# Altium schematic sheet positioningAndThermistor.SchDoc
size A4; DocumentNumber: 7; SheetNumber: 7; SheetTotal: 11
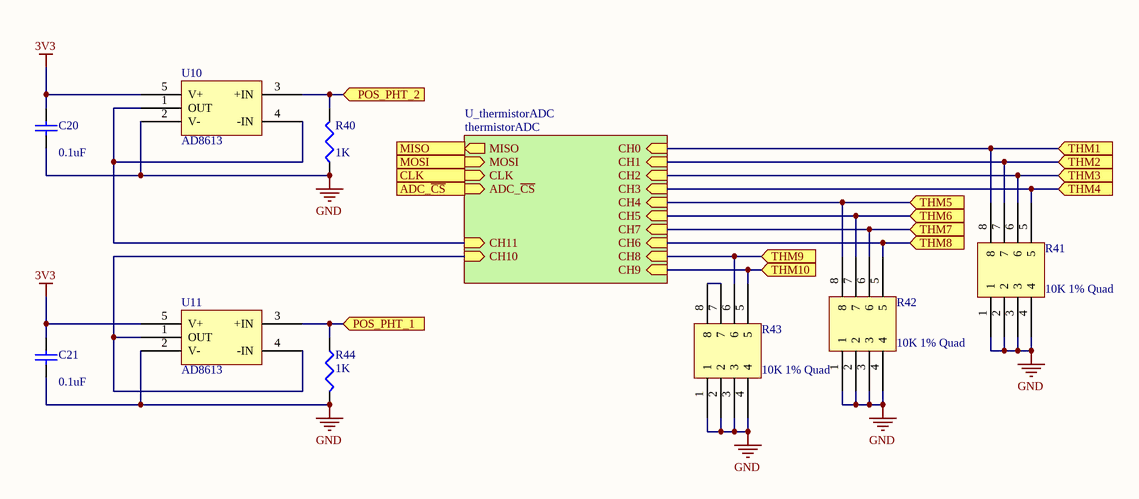
[diagram p0: positioningAndThermistor.SchDoc]

## Parts
C20  0.1uF  [0402]
C21  0.1uF  [0402]
R40  1K  [J1-0603]
R41  10K 1% Quad
R42  10K 1% Quad
R43  10K 1% Quad
R44  1K  [J1-0603]
U10  AD8613  [SOP-65P200X125-5N]
U11  AD8613  [SOP-65P200X125-5N]

## Sub-sheets
U_thermistorADC = thermistorADC: CH0 (in), CH1 (in), CH2 (in), CH3 (in), CH4 (in), CH5 (in), CH7 (in), CH6 (in), CH8 (in), CH9 (in), MOSI (in), MISO (out), ADC_~{CS} (in), CLK (in), CH11 (in), CH10 (in)

## Ports
ADC_~{CS} (in), CLK (in), MISO (out), MOSI (in), POS_PHT_1 (in), POS_PHT_2 (in), THM1 (in), THM2 (in), THM3 (in), THM4 (in), THM5 (in), THM6 (in), THM7 (in), THM8 (in), THM9 (in), THM10 (in)

## Nets
3V3: C20.2 C21.2 U10.5(V+) U11.5(V+)
GND: C20.1 C21.1 R40.1 R41.1 R41.2 R41.3 R41.4 R42.1 R42.2 R42.3 R42.4 R43.1 R43.2 R43.3 R43.4 R44.2 U10.2(V-) U11.2(V-)
ADC_~{CS}: port ADC_~{CS}, sheet U_thermistorADC/ADC_~{CS}
CLK: port CLK, sheet U_thermistorADC/CLK
MISO: port MISO, sheet U_thermistorADC/MISO
MOSI: port MOSI, sheet U_thermistorADC/MOSI
POS_PHT_1: R44.1 U11.3(+IN) ; port POS_PHT_1
POS_PHT_2: R40.2 U10.3(+IN) ; port POS_PHT_2
THM1: R41.8 ; port THM1, sheet U_thermistorADC/CH0
THM2: R41.7 ; port THM2, sheet U_thermistorADC/CH1
THM3: R41.6 ; port THM3, sheet U_thermistorADC/CH2
THM4: R41.5 ; port THM4, sheet U_thermistorADC/CH3
THM5: R42.8 ; port THM5, sheet U_thermistorADC/CH4
THM6: R42.7 ; port THM6, sheet U_thermistorADC/CH5
THM7: R42.6 ; port THM7, sheet U_thermistorADC/CH7
THM8: R42.5 ; port THM8, sheet U_thermistorADC/CH6
THM9: R43.6 ; port THM9, sheet U_thermistorADC/CH8
THM10: R43.5 ; port THM10, sheet U_thermistorADC/CH9
NetR43_7: R43.7 R43.8
NetU10_1: U10.1(OUT) U10.4(-IN) ; sheet U_thermistorADC/CH11
NetU11_1: U11.1(OUT) U11.4(-IN) ; sheet U_thermistorADC/CH10

## Library data of the parts
C20 C21 = Cap Semi: Capacitor (Semiconductor SIM Model); Published: 8-Jun-2000; LatestRevisionDate: 29-May-2009; LatestRevisionNote: IPC-7351 Footprint Added.; PackageReference: C1206; Publisher: Altium Limited; PackageDescription: Chip Capacitor; Value: 0.1uF; Supplier: Digi-Key; Supplier Part Number: 587-3807-1-ND
R40 R44 = Res3: Resistor; Published: 8-Jun-2000; LatestRevisionDate: 29-May-2009; LatestRevisionNote: IPC-7351 Footprint Added.; PackageReference: J1-0603; Publisher: Altium Limited; PackageDescription: Chip Resistor; Value: 1K; Supplier: Digi-Key
R41-R43 = Res Quad Pack: Quad pack resistor; Value: 10K 1% Quad; Supplier: Digi-Key
U10 U11 = AD8613: Low power, low noise rail-to-rail op-amp.; Supplier: Digi-Key